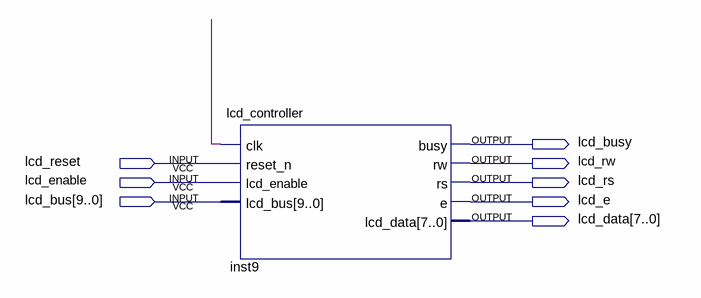
[diagram p0: schematic sheet]
// Quartus schematic old.bdf as structural Verilog: 1 symbols, 8 pins
module old (
  input  lcd_reset,
  input  lcd_enable,
  input  [9:0] lcd_bus,
  output lcd_busy,
  output lcd_rw,
  output lcd_rs,
  output lcd_e,
  output [7:0] lcd_data
);

  wire undriven;

  lcd_controller inst9 (
    .clk(undriven), .reset_n(lcd_reset), .lcd_enable(lcd_enable), .lcd_bus(lcd_bus), .busy(lcd_busy),
    .rw(lcd_rw), .rs(lcd_rs), .e(lcd_e), .lcd_data(lcd_data));
endmodule
